# EAGLE design TriggerBoard_v4.rfm12b (EAGLE 6.5.0)
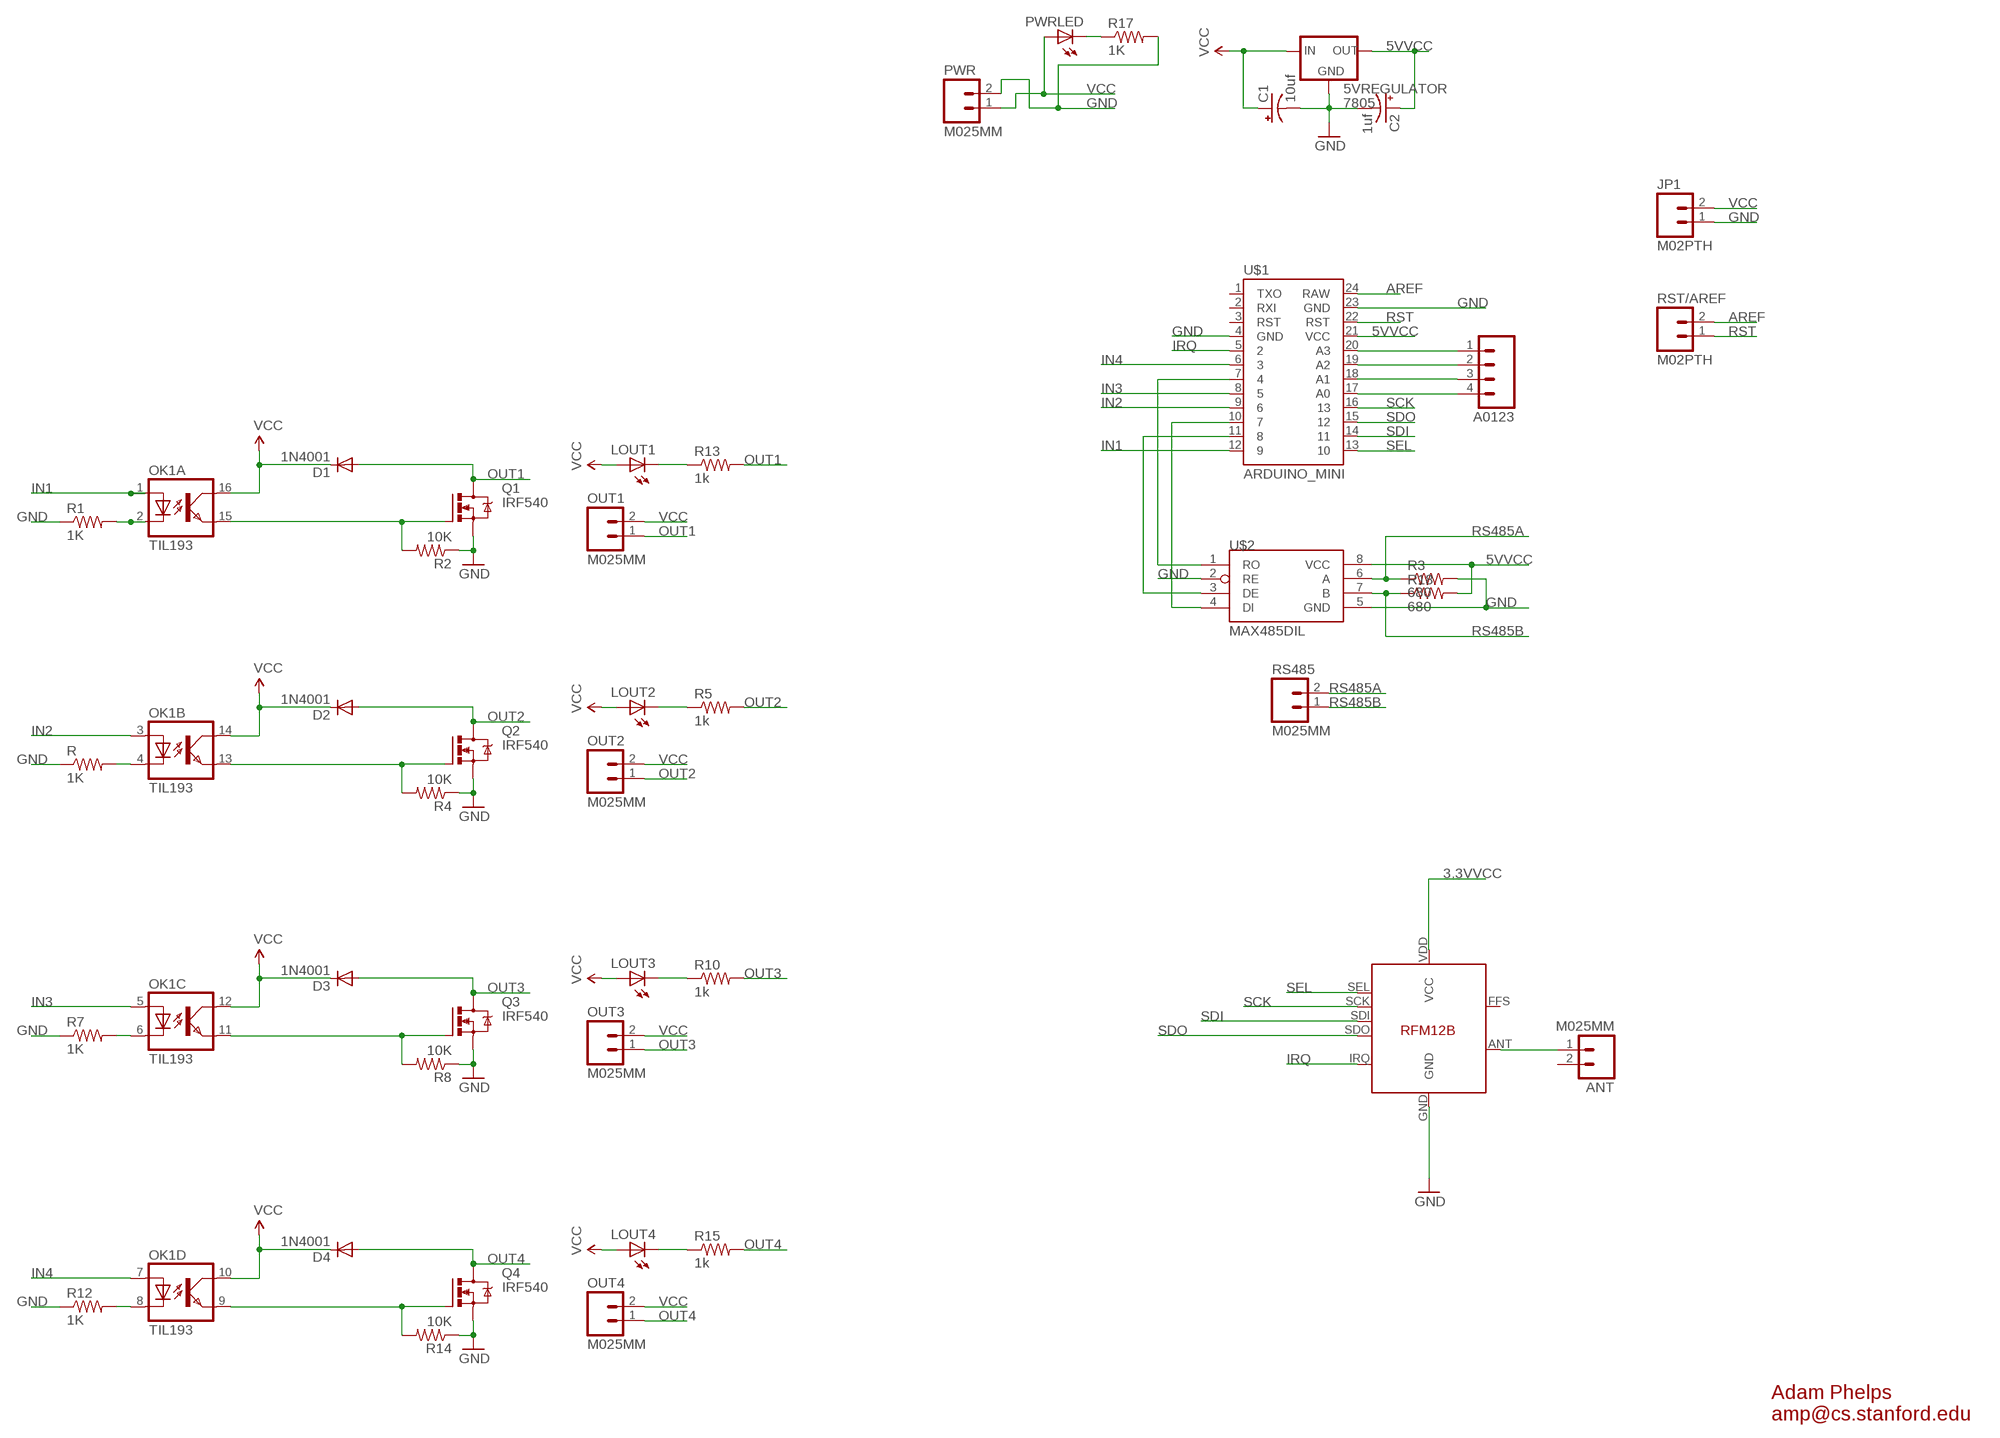
[diagram p0: schematic, sheet 1]

## Parts
5VREGULATOR  7805  V_REG_78XXSINK  [TO220-IGO]
A0123  M04PTH  [1X04]
ANT  M025MM  [SCREWTERMINAL-5MM-2]
C1  10uf  CAP_POLPTH2  [CPOL-RADIAL-10UF-25V]
C2  1uf  CAP_POLPTH2  [CPOL-RADIAL-10UF-25V]
D1  1N4001  DIODEPTH  [DIODE-1N4001]
D2  1N4001  DIODEPTH  [DIODE-1N4001]
D3  1N4001  DIODEPTH  [DIODE-1N4001]
D4  1N4001  DIODEPTH  [DIODE-1N4001]
JP1  M02PTH  [1X02]
LOUT1  LED3MM  [LED3MM]
LOUT2  LED3MM  [LED3MM]
LOUT3  LED3MM  [LED3MM]
LOUT4  LED3MM  [LED3MM]
OK1  TIL193  [DIL16]
OUT1  M025MM  [SCREWTERMINAL-5MM-2]
OUT2  M025MM  [SCREWTERMINAL-5MM-2]
OUT3  M025MM  [SCREWTERMINAL-5MM-2]
OUT4  M025MM  [SCREWTERMINAL-5MM-2]
PWR  M025MM  [SCREWTERMINAL-5MM-2]
PWRLED  LED5MM  [LED5MM]
Q1  IRF540  [TO220BV]
Q2  IRF540  [TO220BV]
Q3  IRF540  [TO220BV]
Q4  IRF540  [TO220BV]
R  1K  RESISTORPTH-1/4W  [AXIAL-0.4]
R1  1K  RESISTORPTH-1/4W  [AXIAL-0.4]
R2  10K  RESISTORPTH-1/4W  [AXIAL-0.4]
R3  680  RESISTORPTH-1/4W  [AXIAL-0.4]
R4  10K  RESISTORPTH-1/4W  [AXIAL-0.4]
R5  1k  RESISTORPTH-1/4W  [AXIAL-0.4]
R7  1K  RESISTORPTH-1/4W  [AXIAL-0.4]
R8  10K  RESISTORPTH-1/4W  [AXIAL-0.4]
R10  1k  RESISTORPTH-1/4W  [AXIAL-0.4]
R12  1K  RESISTORPTH-1/4W  [AXIAL-0.4]
R13  1k  RESISTORPTH-1/4W  [AXIAL-0.4]
R14  10K  RESISTORPTH-1/4W  [AXIAL-0.4]
R15  1k  RESISTORPTH-1/4W  [AXIAL-0.4]
R17  1K  RESISTORPTH-1/4W  [AXIAL-0.4]
R18  680  RESISTORPTH-1/4W  [AXIAL-0.4]
RS485  M025MM  [SCREWTERMINAL-5MM-2]
RST/AREF  M02PTH  [1X02]
U$1  ARDUINO_MINI  [ARDUINO_MINI]
U$2  MAX485DIL  [DIL08]
U$3  RFM12B  [RFM12B]

## Nets
3.3VVCC: U$3.VDD(VCC)
5VVCC: 5VREGULATOR.OUT C2.1(+) R18.P$2 U$1.21(VCC) U$2.8(VCC)
AREF: RST/AREF.2 U$1.24(RAW)
GND: 5VREGULATOR.GND C1.2(-) C2.2(-) JP1.1 PWR.2 Q1.S Q2.S Q3.S Q4.S R1.P$1 R2.P$1 R3.P$2 R4.P$1 R7.P$1 R8.P$1 R12.P$1 R14.P$1 R17.P$2 R.P$1 U$1.4(GND) U$1.23(GND) U$2.2(RE) U$2.5(GND) U$3.GND
IN1: OK1.1(A:A) U$1.12
IN2: OK1.3(B:A) U$1.9
IN3: OK1.5(C:A) U$1.8
IN4: OK1.7(D:A) U$1.6
IRQ: U$1.5 U$3.IRQ
N$1: LOUT1.K(C) R13.P$1
N$2: OK1.4(B:C) R.P$2
N$3: A0123.4 U$1.17(A0)
N$4: OK1.15(A:EMIT) Q1.G R2.P$2
N$5: OK1.13(B:EMIT) Q2.G R4.P$2
N$6: OK1.2(A:C) R1.P$2
N$7: LOUT2.K(C) R5.P$1
N$8: ANT.1 U$3.ANT
N$9: OK1.11(C:EMIT) Q3.G R8.P$2
N$10: LOUT3.K(C) R10.P$1
N$11: OK1.6(C:C) R7.P$2
N$13: OK1.9(D:EMIT) Q4.G R14.P$2
N$14: LOUT4.K(C) R15.P$1
N$15: OK1.8(D:C) R12.P$2
N$17: PWRLED.K(C) R17.P$1
N$18: A0123.3 U$1.18(A1)
N$19: U$1.11 U$2.3(DE)
N$20: U$1.7 U$2.1(RO)
N$21: U$1.10 U$2.4(DI)
N$25: A0123.2 U$1.19(A2)
N$26: A0123.1 U$1.20(A3)
OUT1: D1.A OUT1.1 Q1.D R13.P$2
OUT2: D2.A OUT2.1 Q2.D R5.P$2
OUT3: D3.A OUT3.1 Q3.D R10.P$2
OUT4: D4.A OUT4.1 Q4.D R15.P$2
RS485A: R3.P$1 RS485.2 U$2.6(A)
RS485B: R18.P$1 RS485.1 U$2.7(B)
RST: RST/AREF.1 U$1.22(RST)
SCK: U$1.16 U$3.SCK
SDI: U$1.14 U$3.SDI
SDO: U$1.15 U$3.SDO
SEL: U$1.13 U$3.SEL
VCC: 5VREGULATOR.IN C1.1(+) D1.C D2.C D3.C D4.C JP1.2 LOUT1.A LOUT2.A LOUT3.A LOUT4.A OK1.10(D:COL) OK1.12(C:COL) OK1.14(B:COL) OK1.16(A:COL) OUT1.2 OUT2.2 OUT3.2 OUT4.2 PWR.1 PWRLED.A
Unconnected: ANT.2 U$1.1(TXO) U$1.2(RXI) U$1.3(RST) U$3.FFS

## Notes on the sheet
- Adam Phelps
  amp@cs.stanford.edu

## Library data of the parts
5VREGULATOR = SparkFun-PowerIC:V_REG_78XX: Voltage Regulator Standard 7805 5V regulator. IGO (Input Ground Output). Spark Fun Electronics SKU : COM-00107
A0123 = SparkFun-Connectors:M04: Header 4 Standard 4-pin 0.1" header. Use with straight break away headers (SKU : PRT-00116), right angle break away headers (PRT-00553), swiss pins (PRT-00743), machine pins (PRT-00117), and female headers (PRT-00115). Molex polarized connector foot print use with SKU : PRT-08231 with associated crimp pins and housings. 1MM SMD Version SKU: PRT-10208
ANT JP1 OUT1-OUT4 PWR RS485 RST/AREF = SparkFun-Connectors:M02: Standard 2-pin 0.1" header. Use with - straight break away headers ( PRT-00116) - right angle break away headers (PRT-00553) - swiss pins (PRT-00743) - machine pins (PRT-00117) - female headers (PRT-00115) Molex polarized connector foot print use with: PRT-08233 with associated crimp pins and housings. 2.54_SCREWTERM for use with PRT-10571. 3.5mm Screw Terminal footprints for PRT-08084 5mm Screw Terminal footprints for use with PRT-08433
C1 C2 = SparkFun-Capacitors:CAP_POL: Capacitor Polarized These are standard SMD and PTH capacitors. Normally 10uF, 47uF, and 100uF in electrolytic and tantalum varieties. Always verify the external diameter of the through hole cap, it varies with capacity, voltage, and manufacturer. The EIA devices should be standard.
D1-D4 = SparkFun-DiscreteSemi:DIODE: Diode These are standard reverse protection diodes and small signal diodes. SMA package can handle up to about 1A. SOD-323 can handle about 200mA. What the SOD-323 package when ordering, there are some mfgs out there that are 5-pin packages.
LOUT1-LOUT4 PWRLED = SparkFun-LED:LED: LEDs Standard schematic elements and footprints for 5mm, 3mm, 1206, and 0603 sized LEDs. 5mm - Spark Fun Electronics SKU : COM-00529 (and others)
OK1 = optocoupler:TIL193: TEXAS INSTRUMENTS OPTO COUPLER; OC_FARNELL: 1683365; OC_NEWARK: unknown
Q1-Q4 = transistor-power:IRF540: HEXFET Power MOSFET
R R1-R5 R7 R8 R10 R12-R15 R17 R18 = SparkFun-Resistors:RESISTOR: Resistor Basic schematic elements and footprints for 0603, 1206, and PTH resistors.
U$1 = SparkFun-Boards:ARDUINO_MINI: Arduino Pro Mini footprint
U$2 = SparkFun-DigitalIC:MAX485: RS-485 transceiver
U$3 = JeeParts:RFM12B

## Board
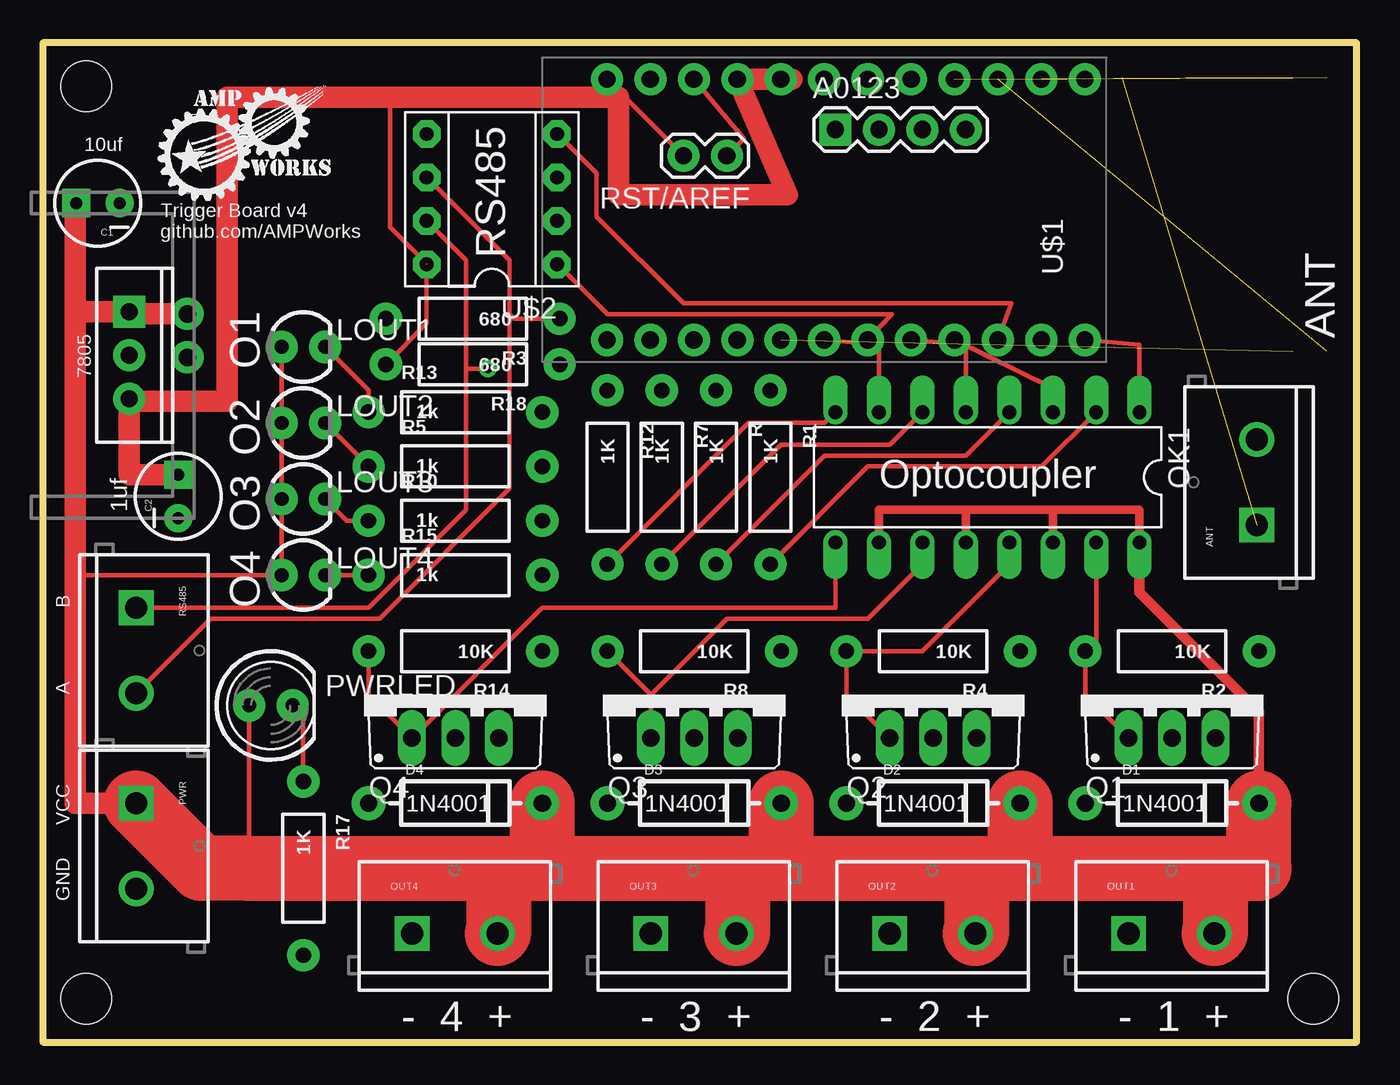
[diagram p1: board, top side]
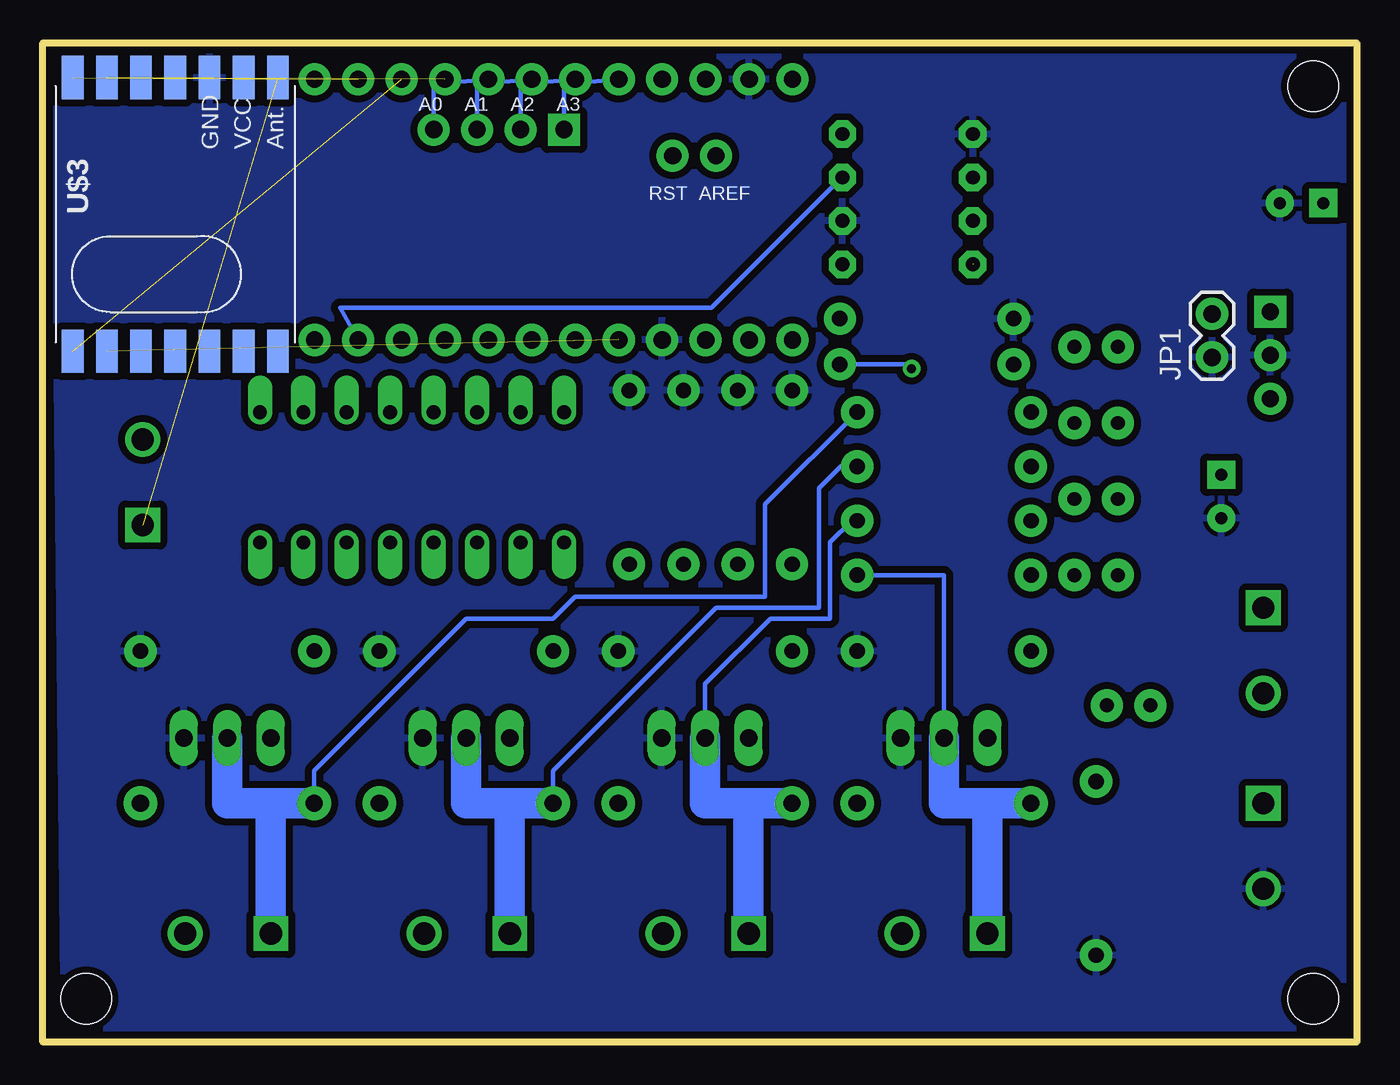
[diagram p2: board, bottom side, seen from below]

Size 76.83 x 58.42 mm. Coordinates in mm from the lower left corner, seen from the top.
Outline: 0,0 76.83,0 76.83,58.42 0,58.42 0,0
Copper layers (1*16): Top 0.035mm / dielectric 1.5mm / Bottom 0.035mm
Design rules "SparkFun-2-layer": minimum track width 7mil, minimum drill 15mil, track to track 8mil, track to pad 8mil, pad to pad 8mil, via to via 8mil, smd to smd 8mil, copper to edge 8mil, drill to drill 8mil, minimum pad ring 12mil, minimum via ring 10mil, stop-mask expansion 4mil, vias tented up to drill 20mil, thermal gap 10mil
Holes 2.92 mm at 74.3,2.54 2.54,55.88 2.54,2.54

### Footprints (pad centres in the part's own frame; a part is rotated, then mirrored left to right if it is on the bottom)
TO220-IGO = drill 1 pad 1.88: GND 0,0; OUT 2.54,0 | drill 1 pad 1.88 square: IN -2.54,0
1X04 = drill 1.016 pad 1.88 square: 1 0,0 | drill 1.016 pad 1.88: 2 2.54,0; 3 5.08,0; 4 7.62,0
SCREWTERMINAL-5MM-2 = drill 1.3 pad 2.032 square: 1 0,0 | drill 1.3 pad 2.032: 2 5,0
CPOL-RADIAL-10UF-25V = drill 0.7 pad 1.651 square: 1 1.27,0 | drill 0.7 pad 1.651: 2 -1.27,0
DIODE-1N4001 = drill 1 pad 1.981: A -5.08,0; C 5.08,0
1X02 = drill 1.016 pad 1.88: 1 0,0; 2 2.54,0
LED3MM = drill 0.813 pad 1.88: A -1.27,0; K 1.27,0
DIL16 = drill 0.813 offset: 1 -8.89,-3.81; 2 -6.35,-3.81; 3 -3.81,-3.81; 4 -1.27,-3.81; 5 1.27,-3.81; 6 3.81,-3.81; 7 6.35,-3.81; 8 8.89,-3.81; 9 8.89,3.81; 10 6.35,3.81; 11 3.81,3.81; 12 1.27,3.81; 13 -1.27,3.81; 14 -3.81,3.81; 15 -6.35,3.81; 16 -8.89,3.81
LED5MM = drill 0.813 pad 1.88: A -1.27,0; K 1.27,0
TO220BV = drill 1.016 long: D 0,-2.54; G -2.54,-2.54; S 2.54,-2.54
AXIAL-0.4 = drill 0.9 pad 1.88: P$1 -5.08,0; P$2 5.08,0
ARDUINO_MINI = drill 1.016 pad 1.88: 1 -7.62,12.7; 2 -7.62,10.16; 3 -7.62,7.62; 4 -7.62,5.08; 5 -7.62,2.54; 6 -7.62,0; 7 -7.62,-2.54; 8 -7.62,-5.08; 9 -7.62,-7.62; 10 -7.62,-10.16; 11 -7.62,-12.7; 12 -7.62,-15.24; 13 7.62,-15.24; 14 7.62,-12.7; 15 7.62,-10.16; 16 7.62,-7.62; 17 7.62,-5.08; 18 7.62,-2.54; 19 7.62,0; 20 7.62,2.54; 21 7.62,5.08; 22 7.62,7.62; 23 7.62,10.16; 24 7.62,12.7
DIL08 = drill 0.813 pad 1.6 octagon: 1 -3.81,-3.81; 2 -1.27,-3.81; 3 1.27,-3.81; 4 3.81,-3.81; 5 3.81,3.81; 6 1.27,3.81; 7 -1.27,3.81; 8 -3.81,3.81
RFM12B = smd 2.54 x 1.27: ANT 8,-6; FFS -8,2; GND 8,-2; IRQ -8,4; P$8 -8,0; P$9 -8,-2; P$10 -8,-4; P$12 -8,-6; P$16 8,0; SCK 8,4; SDI 8,2; SDO -8,6; SEL 8,6; VDD 8,-4

### Placement (x,y rotation side)
5VREGULATOR  5.05,40.16 270 top
A0123  46.35,53.34 0 top
ANT  70.99,30.23 90 top
C1  3.23,49.05 180 top
C2  7.92,31.9 90 top
D1  66.04,13.97 0 top
D2  52.07,13.97 0 top
D3  38.1,13.97 0 top
D4  24.13,13.97 0 top
JP1  8.46,40.03 90 bottom
LOUT1  15.24,40.64 0 top
LOUT2  15.24,36.2 0 top
LOUT3  15.24,31.75 0 top
LOUT4  15.24,27.3 0 top
OK1  55.24,33.02 180 top
OUT1  63.5,6.35 0 top
OUT2  49.53,6.35 0 top
OUT3  35.56,6.35 0 top
OUT4  21.59,6.35 0 top
PWR  5.46,13.97 270 top
PWRLED  13.34,19.68 0 top
Q1  66.04,20.32 0 top
Q2  52.07,20.32 0 top
Q3  38.1,20.32 0 top
Q4  24.13,20.32 0 top
R  39.37,33.02 270 top
R1  42.55,33.02 270 top
R2  66.04,22.86 180 top
R3  25.15,42.29 180 top
R4  52.07,22.86 180 top
R5  24.13,33.66 0 top
R7  36.2,33.02 270 top
R8  38.1,22.86 180 top
R10  24.13,30.48 0 top
R12  33.02,33.02 270 top
R13  24.13,36.83 0 top
R14  24.13,22.86 180 top
R15  24.13,27.3 0 top
R17  15.24,10.16 270 top
R18  25.15,39.62 180 top
RS485  5.46,25.4 270 top
RST/AREF  40.01,51.82 180 top
U$1  45.69,48.67 90 top
U$2  26.26,49.28 90 top
U$3  69.09,48.39 90 bottom

### Tracks (layer width: path | path; a pad name or v marks a point on that pad's centre or on a via)
5VVCC  (1 unrouted)
  Top 0.254: 22.45,45.49 20.32,47.62 20.32,55.24 | U$2.8 22.45,42.01 R18.P$2
  Top 0.406: 5.05,37.47 5VREGULATOR.OUT
  Top 1.27: 43.81,56.29 U$1.21 43.54,49.53 33.66,49.53 33.66,55.24 20.32,55.24 10.79,55.24 10.79,37.47 5.05,37.47 | C2.1 5.05,33.17 5VREGULATOR.OUT
AREF
  Top 0.254: U$1.24 RST/AREF.2
GND
  pour Bottom (isolate 0.406): 0.64,0.64 75.56,0.64 76.2,57.78 0.64,57.78
IN1
  Top 0.254: OK1.1 64.14,40.77 U$1.12
IN2
  Top 0.254: OK1.3 59.05,38.23 U$1.9
IN3
  Top 0.254: OK1.5 53.98,40.77 U$1.8
IN4
  Top 0.254: OK1.7 48.9,40.77 U$1.6
IRQ  (1 unrouted)
N$1
  Top 0.254: R13.P$1 19.05,38.1 LOUT1.K
N$2
  Top 0.254: R.P$2 45.72,34.29 53.98,34.29 OK1.4
N$3
  Bottom 0.254: U$1.17 53.98,56.01 A0123.4
N$4
  Top 0.254: OK1.15 61.59,23.5 R2.P$2 60.96,20.32 Q1.G
N$5
  Top 0.254: Q2.G 46.99,20.32 R4.P$2 51.44,22.86 56.52,27.94 OK1.13
N$6
  Top 0.254: R1.P$2 48.26,33.66 58.42,33.66 OK1.2
N$7
  Top 0.254: R5.P$1 LOUT2.K
N$8  (1 unrouted)
N$9
  Top 0.254: Q3.G 35.56,20.32 | 35.56,20.32 R8.P$2 | OK1.11 51.44,27.94 48.26,24.77 40.01,24.77 35.56,20.32
N$10
  Top 0.254: R10.P$1 17.78,30.48 LOUT3.K
N$11
  Top 0.254: R7.P$2 43.18,34.92 49.53,34.92 OK1.6
N$13
  Top 0.254: OK1.9 46.35,25.4 29.21,25.4 Q4.G 19.05,20.32 R14.P$2
N$14
  Top 0.254: LOUT4.K R15.P$1
N$15
  Top 0.254: R12.P$2 41.27,36.2 45.72,36.2 OK1.8
N$17
  Top 0.254: PWRLED.K 15.24,19.05 R17.P$1
N$18
  Bottom 0.254: U$1.18 51.44,56.01 A0123.3
N$19
  Bottom 0.254: U$2.3 30.1,50.55 37.72,42.93 59.44,42.93 U$1.11
N$20
  Top 0.254: U$1.7 49.66,42.55 33.02,42.55 30.1,45.47 U$2.1
N$21
  Top 0.254: U$1.10 56.64,43.18 37.47,43.18 32.38,48.26 32.38,50.8 30.1,53.09 U$2.4
N$25
  Bottom 0.254: U$1.19 48.9,56.01 A0123.2
N$26
  Bottom 0.254: U$1.20 46.35,56.01 A0123.1
OUT1
  Bottom 0.254: D1.A 60.96,15.88 52.07,24.77 46.99,24.77 45.72,26.04 34.61,26.04 34.61,31.43 R13.P$2
  Bottom 1.778: OUT1.1 63.5,13.97 D1.A 66.04,13.97 Q1.D
OUT2
  Bottom 0.254: D2.A 46.99,15.88 37.47,25.4 31.43,25.4 31.43,32.38 30.16,33.66 R5.P$2
  Bottom 1.778: OUT2.1 49.53,13.97 D2.A 52.07,13.97 Q2.D
OUT3
  Bottom 0.254: Q3.D 38.1,20.95 34.29,24.77 30.8,24.77 30.8,29.21 29.53,30.48 R10.P$2
  Bottom 1.778: OUT3.1 35.56,13.97 D3.A 38.1,13.97 Q3.D
OUT4
  Bottom 0.254: Q4.D 24.13,27.3 R15.P$2
  Bottom 1.778: OUT4.1 21.59,13.97 D4.A 24.13,13.97 Q4.D
RS485A
  Top 0.254: U$2.6 27.3,45.7 27.3,42.55 | 27.3,42.55 27.3,32.38 19.68,24.77 9.83,24.77 RS485.2 | R3.P$1 27.56,42.29 27.3,42.55
RS485B  (via drill 0.51)
  Top 0.254: RS485.1 19.05,25.4 24.77,31.11 24.77,39.37 | 24.77,39.37 24.77,45.7 U$2.7 | v26.04,39.37 24.77,39.37
  Bottom 0.254: R18.P$1 26.29,39.62 v26.04,39.37
RST
  Top 0.254: U$1.22 41,52.81 RST/AREF.1
SCK  (1 unrouted)
SDI  (1 unrouted)
SDO  (1 unrouted)
SEL  (1 unrouted)
VCC
  Top 0.254: PWRLED.A 12.06,10.16 | LOUT1.A LOUT2.A LOUT3.A LOUT4.A 1.91,27.3
  Top 0.406: 1.91,49 C1.1
  Top 0.508: OK1.14 59.05,31.11 | 59.05,31.11 53.98,31.11 | OK1.12 53.98,31.11 | 53.98,31.11 48.9,31.11 OK1.10 | OK1.16 64.14,31.11 59.05,31.11
  Top 0.61: OK1.16 64.14,26.29 71.12,19.3 D1.C
  Top 1.27: 1.91,49 1.91,42.7 | 1.91,42.7 1.91,27.3 1.91,13.97 PWR.1 | JP1.2 5.05,42.57 5VREGULATOR.IN 1.91,42.7
  Top 3.81: 26.67,10.16 12.06,10.16 9.27,10.16 PWR.1 | 26.67,10.16 29.21,10.16 | 29.21,10.16 40.64,10.16 | 40.64,10.16 43.18,10.16 | 43.18,10.16 54.61,10.16 | 54.61,10.16 57.15,10.16 | 57.15,10.16 68.58,10.16 | 68.58,10.16 71.12,10.16 D1.C | OUT1.2 68.58,6.43 68.58,10.16 | D2.C 57.15,10.16 | OUT2.2 54.61,6.43 54.61,10.16 | D3.C 43.18,10.16 | OUT3.2 40.64,6.43 40.64,10.16 | D4.C 29.21,10.16 | OUT4.2 26.67,6.43 26.67,10.16

### Text on the board
tPlace: 10uf | Trigger Board v4 | github.com/AMPWorks | RS485 | 7805 | ANT | O1 | O2 | Optocoupler | 1uf | O3 | B | O4 | A | VCC | GND | /Users/amp/Dropbox/Techshop/Drawings/General/amp_works_2in.bmp | - 4 + | - 3 + | - 2 + | - 1 +
bPlace: A0 A1 A2 A3 | RST AREF